# EAGLE design RH036.2 (EAGLE 7.1.0)
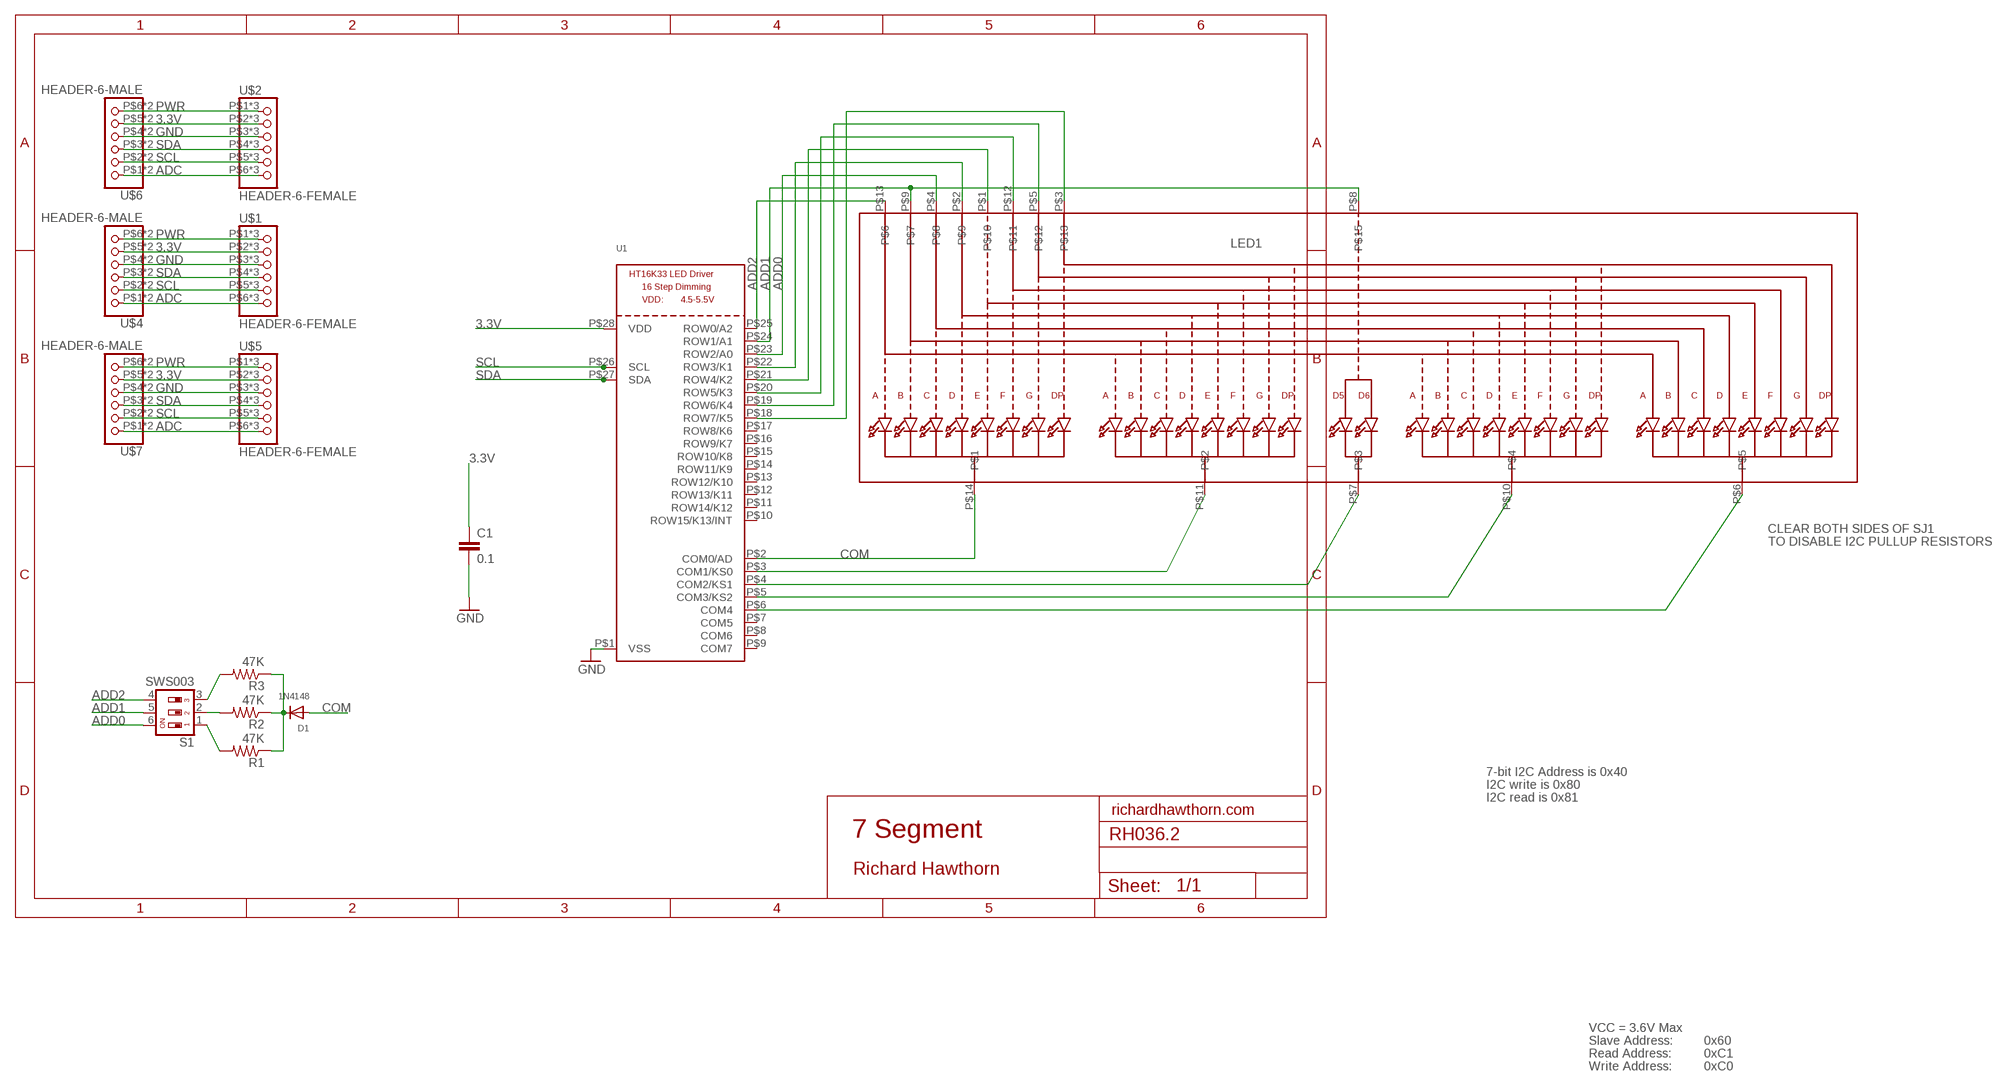
[diagram p0: schematic, sheet 1]

## Parts
C1  0.1  CAP0603-CAP  [0603-CAP]
D1  1N4148  DIODESOD-323F  [SOD-323F]
LED1  DISP_SEGMENT_4DIGIT_BL-Q56C43  [SEGMENT-BL-Q56C43]
R1  47K  R-US_R0805  [R0805]
R2  47K  R-US_R0805  [R0805]
R3  47K  R-US_R0805  [R0805]
S1  SWS003  [SMS-003]
U1  HT16K33_SOP28  [SOP28_300MIL]
U$1  HEADER-6-FEMALE  [2MMHEADER6]
U$2  HEADER-6-FEMALE  [2MMHEADER6]
U$4  HEADER-6-MALE  [2MMHEADERPIN6]
U$5  HEADER-6-FEMALE  [2MMHEADER6]
U$6  HEADER-6-MALE  [2MMHEADERPIN6]
U$7  HEADER-6-MALE  [2MMHEADERPIN6]

## Nets
3.3V: C1.1 U1.P$28(VDD) U$1.P$2 U$1.P$10 U$1.P$18 U$2.P$2 U$2.P$10 U$2.P$18 U$4.P$5 U$4.P$13 U$5.P$2 U$5.P$10 U$5.P$18 U$6.P$5 U$6.P$13 U$7.P$5 U$7.P$13
ADC: U$1.P$6 U$1.P$14 U$1.P$22 U$2.P$6 U$2.P$14 U$2.P$22 U$4.P$1 U$4.P$9 U$5.P$6 U$5.P$14 U$5.P$22 U$6.P$1 U$6.P$9 U$7.P$1 U$7.P$9
ADD0: LED1.P$4 S1.6 U1.P$23(ROW2/A0)
ADD1: LED1.P$8 LED1.P$9 S1.5 U1.P$24(ROW1/A1)
ADD2: LED1.P$13 S1.4 U1.P$25(ROW0/A2)
COM: D1.A LED1.P$14 U1.P$2(COM0/AD)
GND [power]: C1.2 U1.P$1(VSS) U$1.P$3 U$1.P$11 U$1.P$19 U$2.P$3 U$2.P$11 U$2.P$19 U$4.P$4 U$4.P$12 U$5.P$3 U$5.P$11 U$5.P$19 U$6.P$4 U$6.P$12 U$7.P$4 U$7.P$12
N$5: R3.2 S1.3
N$7: LED1.P$11 U1.P$3(COM1/KS0)
N$8: LED1.P$7 U1.P$4(COM2/KS1)
N$9: LED1.P$10 U1.P$5(COM3/KS2)
N$10: LED1.P$6 U1.P$6(COM4)
N$11: LED1.P$2 U1.P$22(ROW3/K1)
N$12: LED1.P$1 U1.P$21(ROW4/K2)
N$13: LED1.P$12 U1.P$20(ROW5/K3)
N$15: LED1.P$5 U1.P$19(ROW6/K4)
N$16: LED1.P$3 U1.P$18(ROW7/K5)
N$17: D1.C R1.1 R2.1 R3.1
N$18: R1.2 S1.1
N$19: R2.2 S1.2
PWR [power]: U$1.P$1 U$1.P$9 U$1.P$17 U$2.P$1 U$2.P$9 U$2.P$17 U$4.P$6 U$4.P$14 U$5.P$1 U$5.P$9 U$5.P$17 U$6.P$6 U$6.P$14 U$7.P$6 U$7.P$14
SCL: U1.P$26(SCL) U$1.P$5 U$1.P$13 U$1.P$21 U$2.P$5 U$2.P$13 U$2.P$21 U$4.P$2 U$4.P$10 U$5.P$5 U$5.P$13 U$5.P$21 U$6.P$2 U$6.P$10 U$7.P$2 U$7.P$10
SDA: U1.P$27(SDA) U$1.P$4 U$1.P$12 U$1.P$20 U$2.P$4 U$2.P$12 U$2.P$20 U$4.P$3 U$4.P$11 U$5.P$4 U$5.P$12 U$5.P$20 U$6.P$3 U$6.P$11 U$7.P$3 U$7.P$11
Unconnected: U1.P$7(COM5) U1.P$8(COM6) U1.P$9(COM7) U1.P$10(ROW15/K13/INT) U1.P$11(ROW14/K12) U1.P$12(ROW13/K11) U1.P$13(ROW12/K10) U1.P$14(ROW11/K9) U1.P$15(ROW10/K8) U1.P$16(ROW9/K7) U1.P$17(ROW8/K6)

## Notes on the sheet
- CLEAR BOTH SIDES OF SJ1
- TO DISABLE I2C PULLUP RESISTORS
- 7-bit I2C Address is 0x40
- I2C write is 0x80
- I2C read is 0x81
- richardhawthorn.com
- 7 Segment
- Richard Hawthorn
- VCC = 3.6V Max
- Slave Address: | 0x60
- Read Address: | 0xC1
- Write Address: | 0xC0

## Library data of the parts
C1 = LowPowerLab:CAP: Capacitor Standard 0603 ceramic capacitor, and 0.1" leaded capacitor.
D1 = adafruit:DIODE: Diode SMADIODE - SMA Surface Mount Package 20V 1A Schottky Diode Digikey: 641-1014-6-ND DO-1N4148 - Through Hole Small Current Diode SOD-123 20V 1 A (.5mV Vf) Schottky Diode - Digikey: MBRX120TPMSCT-ND SOD-323 10V 570mA (.38mV Vf, 3ns) Schottky Diode - Digikey: ZLLS410CT-ND SOD-523 30V 30mA Schottky Diode (RB751S-40TE61) - Digikey: RB751S-40TE61CT-ND SOT23-R/W - SOT23 Package (R = Solder Paste/Reflow Ovens, W = Hand-Soldering) BAT54Film 40V 300mA - Digikey: 497-7162-1-ND
LED1 = microbuilder:DISP_SEGMENT_4DIGIT_BL-Q56C43
R1-R3 = adafruit:R-US_: RESISTOR, American symbol
S1 = smd-special:SWS003: SMD Dip Switch 3 pol.
U1 = microbuilder:HT16K33_SOP28
U$1 U$2 U$5 = Richards:HEADER-6-FEMALE
U$4 U$6 U$7 = Richards:HEADER-6-MALE

## Net classes
1 power: width 0.381 mm, clearance 0.254 mm

## Board
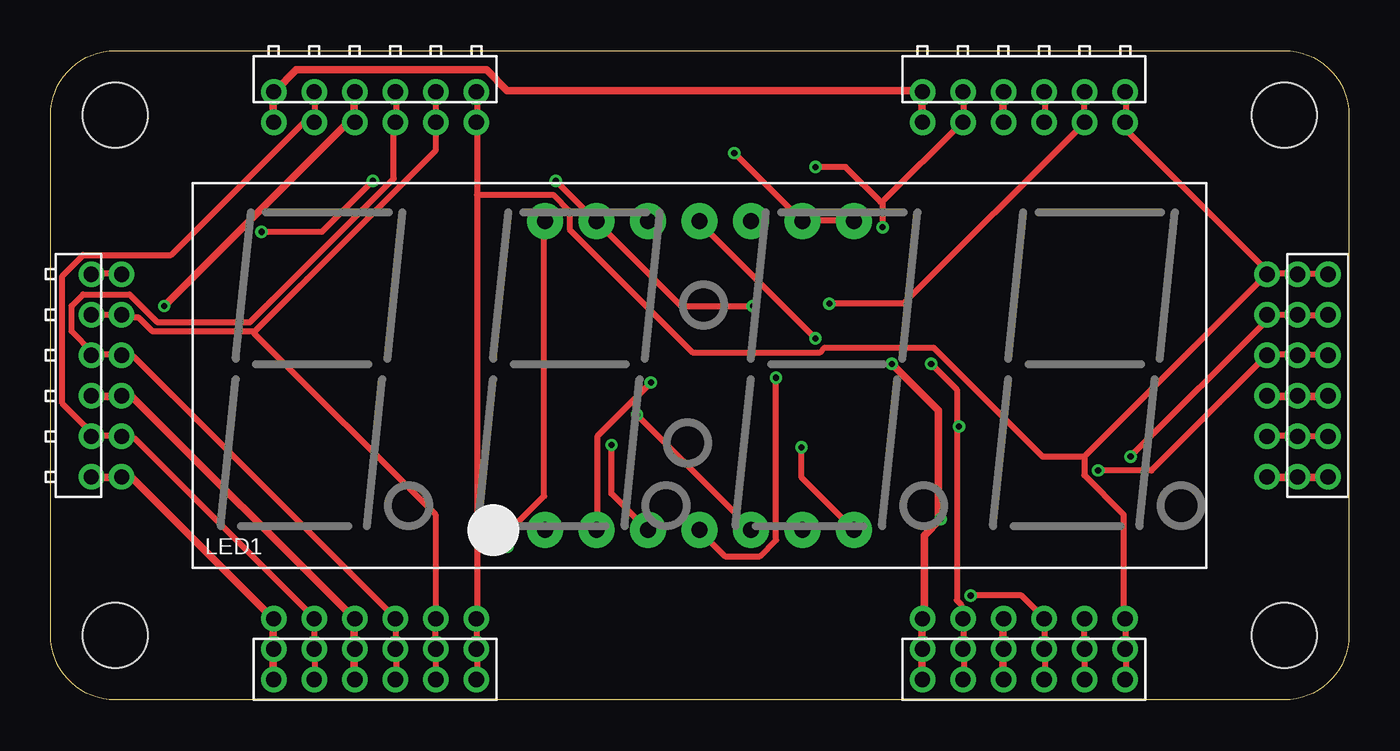
[diagram p1: board, top side]
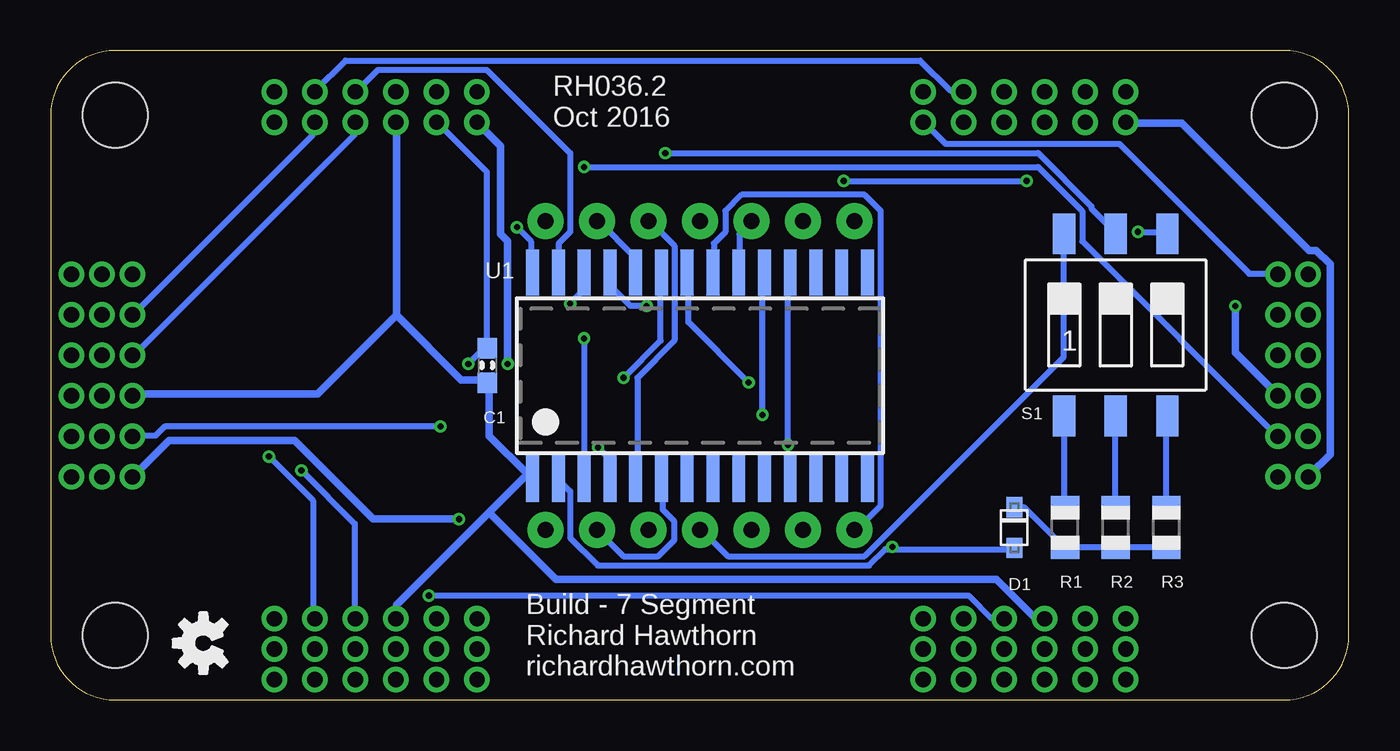
[diagram p2: board, bottom side, seen from below]

Size 64.03 x 32.03 mm. Coordinates in mm from the lower left corner, seen from the top.
Outline: 0,3.17 0,28.86 arc-90 3.17,32.03 60.85,32.03 arc-90 64.03,28.86 64.03,3.17 arc-90 60.85,0 3.17,0 arc-90 0,3.17
Copper layers (1*16): Top 0.035mm / dielectric 1.5mm / Bottom 0.035mm
Design rules "ITEADstudio_DRC *": minimum track width 12mil, minimum drill 12mil, track to track 6mil, track to pad 6mil, pad to pad 6mil, via to via 6mil, smd to smd 0mil, copper to edge 10mil, drill to drill 10mil, minimum pad ring 10mil, minimum via ring 6mil, stop-mask expansion 2mil, vias tented up to drill 100mil, thermal gap 15mil
Holes 3.2 mm at 3.17,3.17 60.85,3.17 3.17,28.86 60.85,28.86
tRestrict: area 0,0 to 5.7,5.7; area 58.3,0 to 64,5.7; area 58.3,26.3 to 64,32; area 0,26.3 to 5.7,32
bRestrict: area 0,26.3 to 5.7,32; area 58.3,26.3 to 64,32; area 58.3,0 to 64,5.7; area 0,0 to 5.7,5.7

### Footprints (pad centres in the part's own frame; a part is rotated, then mirrored left to right if it is on the bottom)
0603-CAP = smd 1.016 x 0.965: 1 -0.85,0; 2 0.85,0
SOD-323F = smd 1 x 0.8: A -1,0; C 1,0
SEGMENT-BL-Q56C43 = drill 0.8 pad 1.778: P$1 -7.62,-7.62; P$2 -5.08,-7.62; P$3 -2.54,-7.62; P$4 0,-7.62; P$5 2.54,-7.62; P$6 5.08,-7.62; P$7 7.62,-7.62; P$8 7.62,7.62; P$9 5.08,7.62; P$10 2.54,7.62; P$11 0,7.62; P$12 -2.54,7.62; P$13 -5.08,7.62; P$14 -7.62,7.62
R0805 = smd 1.1 x 1.4: 1 -1,0; 2 1,0
SMS-003 = smd 1.092 x 2.007: 1 -2.54,-4.496; 2 0,-4.496; 3 2.54,-4.496; 4 2.54,4.496; 5 0,4.496; 6 -2.54,4.496
SOP28_300MIL = smd 0.635 x 2.286: P$1 -8.255,-5.08; P$2 -6.985,-5.08; P$3 -5.715,-5.08; P$4 -4.445,-5.08; P$5 -3.175,-5.08; P$6 -1.905,-5.08; P$7 -0.635,-5.08; P$8 0.635,-5.08; P$9 1.905,-5.08; P$10 3.175,-5.08; P$11 4.445,-5.08; P$12 5.715,-5.08; P$13 6.985,-5.08; P$14 8.255,-5.08; P$15 8.255,5.08; P$16 6.985,5.08; P$17 5.715,5.08; P$18 4.445,5.08; P$19 3.175,5.08; P$20 1.905,5.08; P$21 0.635,5.08; P$22 -0.635,5.08; P$23 -1.905,5.08; P$24 -3.175,5.08; P$25 -4.445,5.08; P$26 -5.715,5.08; P$27 -6.985,5.08; P$28 -8.255,5.08
2MMHEADER6 = drill 0.75: P$1 1,5; P$2 1,3; P$3 1,1; P$4 1,-1; P$5 1,-3; P$6 1,-5; P$9 -0.5,5; P$10 -0.5,3; P$11 -0.5,1; P$12 -0.5,-1; P$13 -0.5,-3; P$14 -0.5,-5; P$17 -2,5; P$18 -2,3; P$19 -2,1; P$20 -2,-1; P$21 -2,-3; P$22 -2,-5
2MMHEADERPIN6 = drill 0.75: P$1 1,5; P$2 1,3; P$3 1,1; P$4 1,-1; P$5 1,-3; P$6 1,-5; P$9 -0.5,5; P$10 -0.5,3; P$11 -0.5,1; P$12 -0.5,-1; P$13 -0.5,-3; P$14 -0.5,-5

### Placement (x,y rotation side)
C1  42.5,16.5 270 bottom
D1  16.5,8.5 90 bottom
LED1  32,16 0 top
R1  14,8.5 90 bottom
R2  11.5,8.5 90 bottom
R3  9,8.5 90 bottom
S1  11.5,18.5 0 bottom
U1  32,16 0 bottom
U$1  48,3 90 top
U$2  16,3 90 top
U$3  [OSHW-LOGO-S]  56.5,2.8 90 bottom
U$4  16,29.5 270 top
U$5  61,16 180 top
U$6  2.5,16 0 top
U$7  48,29.5 270 top

### Tracks (layer width: path | path; a pad name or v marks a point on that pad's centre or on a via)
3.3V  (via drill 0.3)
  Top 0.305: U$4.P$13 13.03,29.95 13.03,28.57 U$4.P$5 12.92,28.46 12.46,28.46 5.94,21.95 1.6,21.95 0.57,20.92 0.57,14.63 2.06,13.14 U$6.P$13 2.06,13.03 3.43,13.03 U$6.P$5 3.54,12.92 4.12,12.92 12.92,4.12 U$2.P$2 13.03,3.89 13.03,2.63 U$2.P$10 13.03,2.4 13.03,1.03 U$2.P$18 | U$5.P$2 60.01,13.03 61.49,13.03 U$5.P$10 61.61,13.03 62.98,13.03 U$5.P$18 | U$1.P$18 45.03,1.03 45.03,2.4 U$1.P$10 45.03,2.63 45.03,3.89 U$1.P$2 44.92,4.12 44.92,4.69 44.69,4.92 44.69,13.49 | 41.03,24.57 v41.03,23.32 | 41.03,24.57 44.92,28.46 U$7.P$5 45.03,28.57 45.03,29.95 U$7.P$13 | 44.69,13.49 44.69,15.32 v43.43,16.57 | v44.81,13.49 44.69,13.49 | v37.72,26.29 39.2,26.29 40.92,24.57 41.03,24.57
  Bottom 0.305: U$7.P$5 44.92,28.46 42.52,26.06 42.52,17.37 C1.1 42.63,17.37 v43.43,16.57 | v41.03,23.32 40.35,22.63 40.35,21.14 U1.P$28 | v44.81,13.49 58.41,13.49 58.86,13.03 59.89,13.03 U$5.P$2 | v37.72,26.29 15.32,26.29 13.14,24.12 13.14,22.63 3.54,13.03 U$6.P$5
ADC
  Top 0.305: U$1.P$22 53.03,1.03 53.03,2.4 U$1.P$14 53.03,2.63 53.03,3.89 U$1.P$6 52.92,4.12 52.92,9.14 50.98,11.09 50.98,12 | U$7.P$9 53.03,29.95 53.03,28.57 U$7.P$1 53.15,28.46 53.15,28 60.01,21.14 U$5.P$6 | U$5.P$6 60.01,21.03 61.49,21.03 U$5.P$14 61.61,21.03 62.98,21.03 U$5.P$22 | 50.98,12 59.89,20.92 U$5.P$6 | U$2.P$22 21.03,1.03 21.03,2.4 U$2.P$14 21.03,2.63 21.03,3.89 U$2.P$6 21.03,4.12 21.03,24.92 | U$6.P$9 2.06,21.03 3.43,21.03 U$6.P$1 | U$4.P$9 21.03,29.95 21.03,28.57 U$4.P$1 21.03,28.46 21.03,24.92 | 50.98,12 48.92,12 43.55,17.37 38.18,17.37 37.95,17.14 31.66,17.14 25.6,23.2 25.6,24.12 24.8,24.92 21.03,24.92
  Bottom 0.305: U$6.P$1 3.54,21.03 4.92,21.03 11.32,27.43 19.89,27.43 20.92,28.46 U$4.P$1
ADD0  (via drill 0.3)
  Top 0.305: v35.78,15.89 35.78,7.89 34.98,7.09 33.26,7.09 32,8.34 LED1.P$4
  Bottom 0.305: S1.6 14.06,22.97 14.06,16.92 23.89,7.09 30.63,7.09 31.89,8.34 LED1.P$4 | v35.78,15.89 33.95,17.72 33.95,21.03 U1.P$23
ADD1  (via drill 0.3)
  Top 0.305: v33.72,26.98 37.03,23.66 LED1.P$9 37.15,23.66 39.55,23.66 LED1.P$8
  Bottom 0.305: v33.72,26.98 15.32,26.98 12.69,24.35 12.69,24.23 11.54,23.09 S1.5 | U1.P$24 35.2,21.14 35.2,21.83 37.03,23.66 LED1.P$9
ADD2  (via drill 0.3)
  Top 0.305: v10.4,23.09 13.37,23.09 v15.89,25.6 | v24.92,25.6 26.86,23.66 LED1.P$13 26.98,23.55 31.09,19.43 v34.63,19.43
  Bottom 0.305: v10.4,23.09 9.03,23.09 S1.4 | v24.92,25.6 v15.89,25.6 | v34.63,19.43 35.43,19.43 36.35,20.34 36.35,21.03 U1.P$25
COM  (via drill 0.3)
  Top 0.305: v22.52,7.54 22.52,8.23 24.35,10.06 24.35,23.55 LED1.P$14
  Bottom 0.305: 22.52,7.43 22.86,7.43 23.66,6.63 37.03,6.63 38.41,8 38.41,10.29 38.98,10.86 U1.P$2 | 22.52,7.43 16.57,7.43 D1.A | v22.52,7.54 22.52,7.43
GND  (via drill 0.3)
  Top 0.381: U$4.P$12 14.97,29.95 14.97,28.57 U$4.P$4 14.86,28.46 14.63,28.46 v5.6,19.43 | U$6.P$12 2.06,14.97 3.43,14.97 U$6.P$4 3.66,14.97 4,14.97 14.86,4.12 U$2.P$3 14.97,3.89 14.97,2.63 U$2.P$11 14.97,2.4 14.97,1.03 U$2.P$19 | U$5.P$3 60.01,14.97 61.49,14.97 U$5.P$11 61.61,14.97 62.98,14.97 U$5.P$19 | U$1.P$19 46.98,1.03 46.98,2.4 U$1.P$11 46.98,2.63 46.98,3.89 U$1.P$3 | U$7.P$4 46.98,28.57 46.98,29.95 U$7.P$12
  Bottom 0.381: v5.6,19.43 5.6,17.14 3.54,15.09 U$6.P$4 | 40.52,11.14 40.35,10.97 U1.P$1 | 40.52,11.14 42.41,13.03 42.41,15.54 C1.2 42.63,15.77 43.78,15.77 46.98,18.97 | 46.98,18.97 46.98,28.46 U$7.P$4 | 40.52,11.14 42.41,9.26 | 42.41,9.26 46.98,4.69 46.98,4 U$1.P$3 | 46.98,18.97 50.86,15.09 59.89,15.09 U$5.P$3 | 42.41,9.26 39.09,5.94 17.37,5.94 15.43,4 15.09,4 U$2.P$3
N$5
  Bottom 0.305: R3.2 9.03,9.6 9.03,13.95 S1.3
N$7  (via drill 0.3)
  Top 0.305: v37.72,17.83 32,23.55 LED1.P$11
  Bottom 0.305: v37.72,17.83 37.72,10.97 U1.P$3
N$8  (via drill 0.3)
  Top 0.305: v37.03,12.46 37.03,10.97 39.55,8.46 LED1.P$7
  Bottom 0.305: v37.03,12.46 36.46,11.89 36.46,10.97 U1.P$4
N$9
  Bottom 0.305: U1.P$5 35.09,10.97 35.09,15.89 33.26,17.72 33.26,22.4 34.52,23.66 LED1.P$10
N$10
  Bottom 0.305: U1.P$6 33.83,10.86 33.83,9.37 33.26,8.8 33.26,7.89 34.06,7.09 35.78,7.09 37.03,8.34 LED1.P$6
N$11  (via drill 0.3)
  Top 0.305: v29.6,15.66 26.98,13.03 26.98,8.46 LED1.P$2
  Bottom 0.305: v29.6,15.66 32.58,18.63 32.58,21.03 U1.P$22
N$12
  Bottom 0.305: U1.P$21 31.32,21.14 31.32,22.52 30.75,23.09 30.75,24.12 29.95,24.92 23.89,24.92 23.09,24.12 23.09,9.6 24.35,8.34 LED1.P$1
N$13
  Bottom 0.305: U1.P$20 30.06,21.14 30.06,22.97 29.49,23.55 LED1.P$12
N$15  (via drill 0.3)
  Top 0.305: v28.92,14.06 34.52,8.46 LED1.P$5
  Bottom 0.305: v28.92,14.06 28.92,21.03 U1.P$19
N$16  (via drill 0.3)
  Top 0.305: v27.66,12.57 27.66,10.17 29.38,8.46 LED1.P$3
  Bottom 0.305: v27.66,12.57 27.66,21.03 U1.P$18
N$17
  Bottom 0.305: R3.1 9.03,7.54 11.43,7.54 R2.1 11.54,7.54 13.95,7.54 R1.1 14.06,7.54 16,9.49 16.46,9.49 D1.C
N$18
  Bottom 0.305: R1.2 14.06,9.6 14.06,13.95 S1.1
N$19
  Bottom 0.305: R2.2 11.54,9.6 11.54,13.95 S1.2
PWR  (via drill 0.3)
  Top 0.381: U$1.P$17 42.98,1.03 42.98,2.4 U$1.P$9 42.98,2.63 42.98,3.89 U$1.P$1 43.09,4.12 43.09,8.12 v43.89,8.91 43.78,9.03 43.78,14.29 v41.49,16.57 | U$5.P$1 60.01,10.97 61.49,10.97 U$5.P$9 61.61,10.97 62.98,10.97 U$5.P$17 | U$7.P$6 42.98,28.57 42.98,29.95 U$7.P$14 42.86,30.06 22.52,30.06 21.49,31.09 12.12,31.09 11.09,30.06 U$4.P$14 10.97,29.95 10.97,28.57 U$4.P$6 | U$6.P$14 2.06,10.97 3.43,10.97 U$6.P$6 3.66,10.97 4,10.97 10.86,4.12 U$2.P$1 10.97,3.89 10.97,2.63 U$2.P$9 10.97,2.4 10.97,1.03 U$2.P$17
  Bottom 0.381: v43.89,8.91 48.12,8.91 52.01,12.8 58.18,12.8 59.89,11.09 U$5.P$1 | U$4.P$6 10.97,28.46 8.23,28.46 1.94,22.17 1.6,22.17 0.91,21.49 0.91,12.12 1.94,11.09 U$6.P$14 | v41.49,16.57 41.49,22.63 41.83,22.97 41.83,27.32 42.98,28.46 U$7.P$6
SCL  (via drill 0.3)
  Top 0.305: U$2.P$21 18.97,1.03 18.97,2.4 U$2.P$13 18.97,2.63 18.97,3.89 U$2.P$5 18.97,4.12 18.97,9.14 10.06,18.06 10.06,18.17 | U$6.P$10 2.06,18.97 3.43,18.97 U$6.P$2 3.54,18.86 4.34,18.86 5.03,18.17 10.06,18.17 | U$4.P$10 18.97,29.95 18.97,28.57 U$4.P$2 18.97,28.35 18.97,27.09 10.06,18.17 | v38.41,19.55 42.06,19.55 50.98,28.46 U$7.P$2 50.98,28.57 50.98,29.95 U$7.P$10 | U$1.P$21 50.98,1.03 50.98,2.4 U$1.P$13 50.98,2.63 50.98,3.89 U$1.P$5 | U$5.P$21 62.98,18.97 61.61,18.97 U$5.P$13 61.49,18.97 60.01,18.97 U$5.P$5 60.12,18.86 v53.26,12
  Bottom 0.305: v38.41,19.55 37.72,20.23 37.72,21.03 U1.P$26 | v53.26,12 51.09,9.83 51.09,4 U$1.P$5 | U$7.P$2 51.09,28.46 51.09,27.89 59.89,19.09 U$5.P$5 | U$4.P$10 19.09,30.06 19.66,30.06 21.14,31.55 49.49,31.55 50.98,30.06 U$7.P$10
SDA  (via drill 0.3)
  Top 0.305: U$4.P$11 17.03,29.95 17.03,28.57 U$4.P$3 16.92,28.46 16.92,25.72 9.83,18.63 5.26,18.63 3.89,20 1.6,20 1.03,19.43 1.03,18.17 2.06,17.14 U$6.P$11 2.06,17.03 3.43,17.03 U$6.P$3 3.54,16.92 4.12,16.92 16.92,4.12 U$2.P$4 17.03,3.89 17.03,2.63 U$2.P$12 17.03,2.4 17.03,1.03 U$2.P$20 | U$7.P$3 49.03,28.57 49.03,29.95 U$7.P$11 | U$1.P$20 49.03,1.03 49.03,2.4 U$1.P$12 49.03,2.63 49.03,3.89 U$1.P$4 48.92,4.12 47.89,5.14 v45.38,5.14 | U$5.P$20 62.98,17.03 61.61,17.03 U$5.P$12 61.49,17.03 60.01,17.03 U$5.P$4 59.89,16.92 54.29,11.32 v51.66,11.32
  Bottom 0.305: U1.P$27 38.98,21.14 38.98,22.52 38.41,23.09 38.41,26.98 42.52,31.09 47.89,31.09 48.92,30.06 U$7.P$11 | v51.66,11.32 49.03,8.69 49.03,4 U$1.P$4 | U$7.P$3 49.03,28.46 49.03,27.89 59.89,17.03 U$5.P$4 | v45.38,5.14 18.75,5.14 17.6,4 17.03,4 U$2.P$4

### Text on the board
bPlace: RH036.2 / Oct 2016 | Build - 7 Segment / Richard Hawthorn / richardhawthorn.com
tDocu: REG